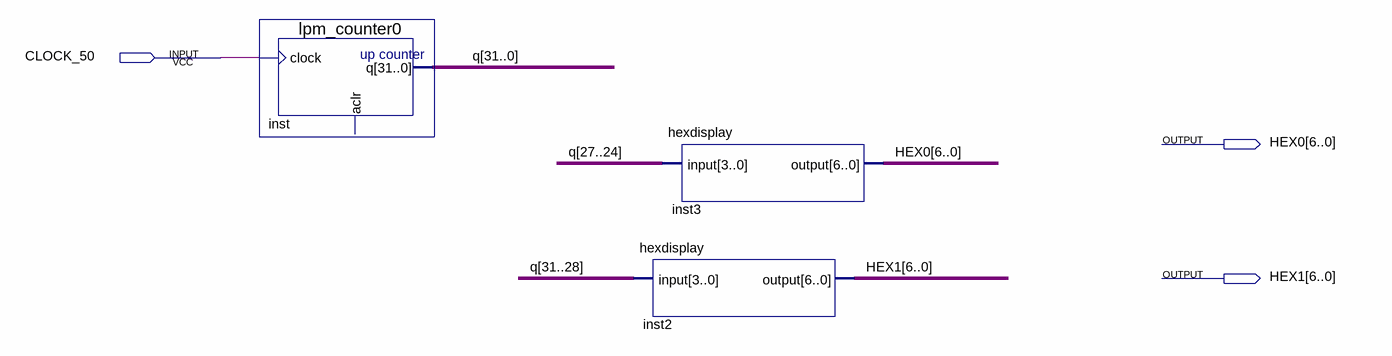
[diagram p0: schematic sheet]
// Quartus schematic task1_top.bdf as structural Verilog: 3 symbols, 3 pins
module task1_top (
  input  CLOCK_50,
  output [6:0] HEX0,
  output [6:0] HEX1
);

  wire [31:0] q;

  lpm_counter0 inst (.clock(CLOCK_50), .q(q));  // open: aclr
  hexdisplay inst3 (.\input (q[27:24]), .\output (HEX0));
  hexdisplay inst2 (.\input (q[31:28]), .\output (HEX1));
endmodule
